# EAGLE schematic LoRaBUG_RGBW_DaughterBoard (EAGLE 8.2.1)
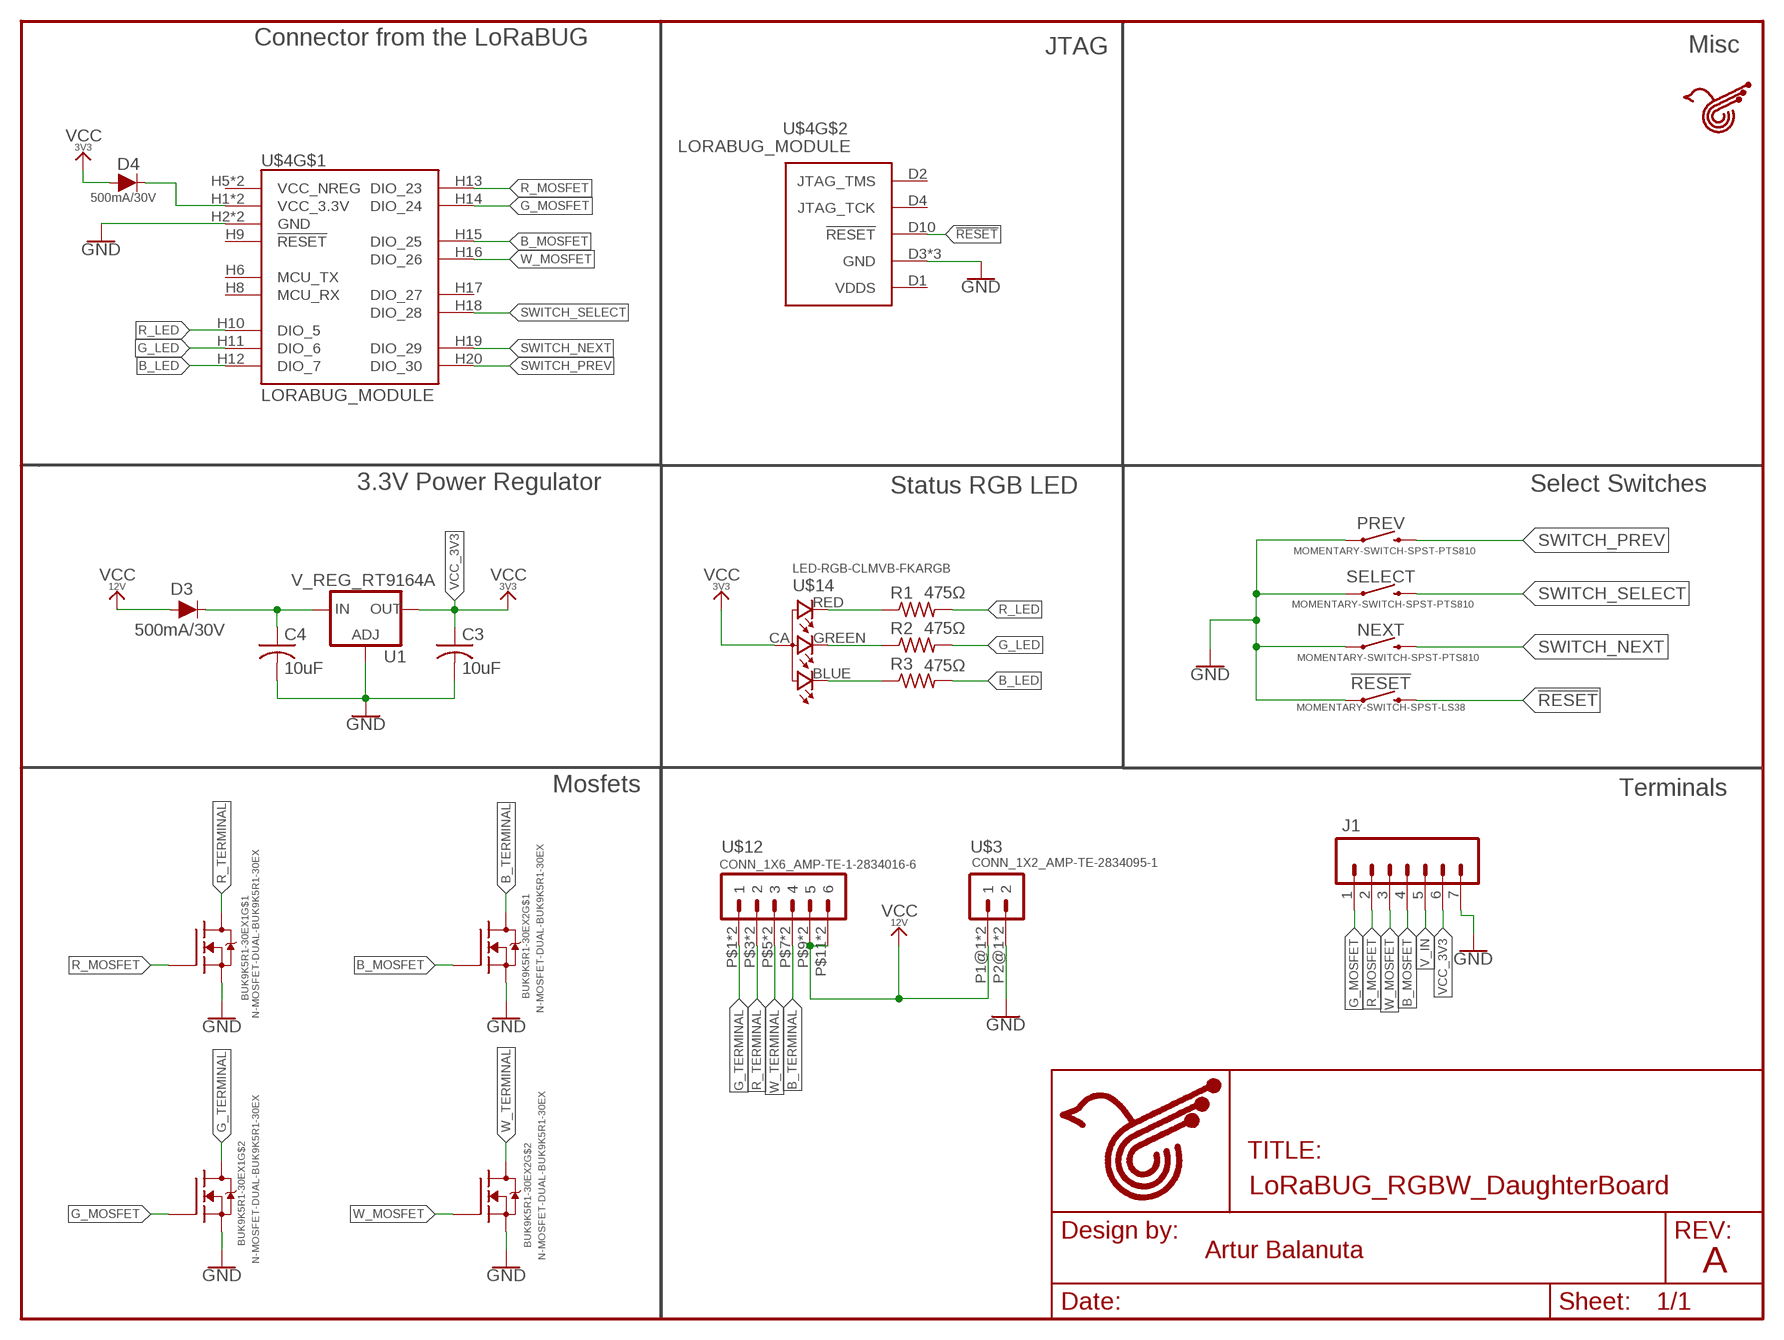
[diagram p0: schematic, sheet 1]

## Parts
!RESET  MOMENTARY-SWITCH-SPST-LS38  [TACTILE_SWITCH_SMD_3.3X3.1MM_LS38]
BUK9K5R1-30EX1  N-MOSFET-DUAL-BUK9K5R1-30EX  [LFPAK56D]
BUK9K5R1-30EX2  N-MOSFET-DUAL-BUK9K5R1-30EX  [LFPAK56D]
C3  10uF  C-USC0603K  [C0603K]
C4  10uF  C-USC0603K  [C0603K]
D3  500mA/30V  DIODE-NSR0530HT1G"  [SOD-323]
D4  500mA/30V  DIODE-NSR0530HT1G"  [SOD-323]
J1  CONN_07NO_SILK  [1X07_NO_SILK]
NEXT  MOMENTARY-SWITCH-SPST-PTS810  [TACTILE_SWITCH_SMD_4.2X3.2MM]
PREV  MOMENTARY-SWITCH-SPST-PTS810  [TACTILE_SWITCH_SMD_4.2X3.2MM]
R1  475Ω  R-US_R0603  [R0603]
R2  475Ω  R-US_R0603  [R0603]
R3  475Ω  R-US_R0603  [R0603]
SELECT  MOMENTARY-SWITCH-SPST-PTS810  [TACTILE_SWITCH_SMD_4.2X3.2MM]
U1  V_REG_RT9164A  [SOT223]
U$3  CONN_1X2_AMP-TE-2834095-1  [CONN_1X2_AMP-TE-2834095-1]
U$4  LORABUG_MODULE  [LORABUG_MODULE]
U$5  OPENCHIR_LOGO_PCB  [OPENCHIRP_LOGO_S]
U$12  CONN_1X6_AMP-TE-1-2834016-6  [CONN_1X6_AMP-TE-1-2834016-6]
U$14  LED-RGB-CLMVB-FKARGB  [PLCC4-2MM-RGB]

## Nets
!RESET: !RESET.P$3 !RESET.P$4 U$4.D10(!RESET)
B_LED: R3.2 U$4.H12(DIO_7)
B_MOSFET: BUK9K5R1-30EX2.P$2(G) J1.4 U$4.H15(DIO_25)
B_TERMINAL: BUK9K5R1-30EX2.P$7(D) BUK9K5R1-30EX2.P$8(D) U$12.P$7 U$12.P$8
G_LED: R2.2 U$4.H11(DIO_6)
G_MOSFET: BUK9K5R1-30EX1.P$4(G) J1.1 U$4.H14(DIO_24)
G_TERMINAL: BUK9K5R1-30EX1.P$5(D) BUK9K5R1-30EX1.P$6(D) U$12.P$1 U$12.P$2
GND: !RESET.P$1 !RESET.P$2 BUK9K5R1-30EX1.P$1(S) BUK9K5R1-30EX1.P$3(S) BUK9K5R1-30EX2.P$1(S) BUK9K5R1-30EX2.P$3(S) C3.2 C4.2 J1.7 NEXT.P$1 NEXT.P$2 PREV.P$1 PREV.P$2 SELECT.P$1 SELECT.P$2 U1.1(ADJ) U$3.P2@1 U$3.P2@2 U$4.D3(GND) U$4.D5(GND) U$4.D9(GND) U$4.H2(GND) U$4.H4(GND)
N$1: R1.1 U$14.RED
N$2: R2.1 U$14.GREEN
N$3: R3.1 U$14.BLUE
N_VIN: C4.1 D3.C U1.3(IN)
R_LED: R1.2 U$4.H10(DIO_5)
R_MOSFET: BUK9K5R1-30EX1.P$2(G) J1.2 U$4.H13(DIO_23)
R_TERMINAL: BUK9K5R1-30EX1.P$7(D) BUK9K5R1-30EX1.P$8(D) U$12.P$3 U$12.P$4
SWITCH_NEXT: NEXT.P$3 NEXT.P$4 U$4.H19(DIO_29)
SWITCH_PREV: PREV.P$3 PREV.P$4 U$4.H20(DIO_30)
SWITCH_SELECT: SELECT.P$3 SELECT.P$4 U$4.H18(DIO_28)
V_IN: D4.C J1.5 U$4.H1(VCC_3.3V) U$4.H3(VCC_3.3V)
VCC_3V3: C3.1 D4.A J1.6 U1.2(OUT) U1.4(OUT) U$14.CA
VCC_12V: D3.A U$3.P1@1 U$3.P1@2 U$12.P$9 U$12.P$10 U$12.P$11 U$12.P$12
W_MOSFET: BUK9K5R1-30EX2.P$4(G) J1.3 U$4.H16(DIO_26)
W_TERMINAL: BUK9K5R1-30EX2.P$5(D) BUK9K5R1-30EX2.P$6(D) U$12.P$5 U$12.P$6
Unconnected: U$4.D2(JTAG_TMS) U$4.D4(JTAG_TCK) U$4.H6(MCU_TX) U$4.H8(MCU_RX) U$4.H9(!RESET) U$4.H17(DIO_27)

## Notes on the sheet
- Connector from the LoRaBUG | Misc
- JTAG
- 3.3V Power Regulator | Status RGB LED | Select Switches
- Mosfets | Terminals
- Artur Balanuta
- A

## Power pins joined to a net without a drawn wire
VCC_NREG: U$4.H5(VCC_NREG) U$4.H7(VCC_NREG)
VDDS: U$4.D1(VDDS)

## Library data of the parts
!RESET NEXT PREV SELECT = LoRaBUG_RGBW_Board:MOMENTARY-SWITCH-SPST
BUK9K5R1-30EX1 BUK9K5R1-30EX2 = LoRaBUG_RGBW_Board:N-MOSFET-DUAL: Dual N-channel TrenchMOS standard level FET NXP Semiconductor. 30V 40A LFPAK56D (SOT 1205)
C3 C4 = resistor:C-US: CAPACITOR, American symbol
D3 D4 = LoRaBUG_RGBW_Board:DIODE-NSR0530HT1G: https://www.digikey.com/product-detail/en/on-semiconductor/NSR0530HT1G/NSR0530HT1GOSCT-ND/5761654; PROD_ID: NSR0530HT1GOSCT-ND
J1 = SparkFun-Connectors:CONN_07: Multi connection point. Often used as Generic Header-pin footprint for 0.1 inch spaced/style header connections On any of the 0.1 inch spaced packages, you can populate with these: Break Away Headers - Straight <https://www.sparkfun.com/products/116> (PRT-00116) Break Away Male Headers - Right Angle <https://www.sparkfun.com/products/553> (PRT-00553) Female Headers <https://www.sparkfun.com/products/115> (PRT-00115) Break Away Headers - Machine Pin <https://www.sparkfun.com/products/117> (PRT-00117) Break Away Female Headers - Swiss Machine Pin <https://www.sparkfun.com/products/743> (PRT-00743) For SCREWTERMINALS and SPRING TERMINALS visit here: Screw Terimnals on SparkFun.com <https://www.sparkfun.com/search/results?term=Screw+Terminals> (5mm/3.5mm/2.54mm spacing) This device is also useful as a general connection point to wire up your design to another part of your project. Our various solder wires solder well into these plated through hole pads. Hook-Up Wire - Assortment (Stranded, 22 AWG) <https://www.sparkfun.com/products/11375> (PRT-11375) Hook-Up Wire - Assortment (Solid Core, 22 AWG) <https://www.sparkfun.com/products/11367> (PRT-11367) View the entire wire category on our website here <https://www.sparkfun.com/categories/141> Special notes: Molex polarized connector foot print use with SKU : PRT-08231 with associated crimp pins and housings. 1MM SMD Version SKU: PRT-10208 NOTES ON THE VARIANTS LOCK and LOCK_LONGPADS... This footprint was designed to help hold the alignment of a through-hole component (i.e. 6-pin header) while soldering it into place. You may notice that each hole has been shifted either up or down by 0.005 of an inch from it's more standard position (which is a perfectly straight line). This slight alteration caused the pins (the squares in the middle) to touch the edges of the holes. Because they are alternating, it causes a "brace" to hold the component in place. 0.005 has proven to be the perfect amount of "off-center" position when using our standard breakaway headers. Although looks a little odd when you look at the bare footprint, once you have a header in there, the alteration is very hard to notice. Also,if you push a header all the way into place, it is covered up entirely on the bottom side.
R1-R3 = resistor:R-US_: RESISTOR, American symbol
U1 = LoRaBUG_RGBW_Board:V_REG_RT9164A: RT9164A Voltage Regulator 1A Fixed and Adjustable Low Dropout Positive Voltage Regulators Features  Low Dropout Performance, 1.4V Max  Full Current Rating Over Line and Temperature  Fast Transient Response  ±2% Output Voltage Accuracy  1.5V, 1.8V, 2.5V, 2.85V, 3.0V, 3.3V, and 3.5V Fixed Adjustable Output Voltage  SOT-223, TO-252, and TO-263 Packages  RoHS Compliant and 100% Lead (Pb)-Free
U$3 = LoRaBUG_RGBW_Board:CONN_1X2_AMP-TE-2834095-1
U$4 = LoRaBUG_RGBW_Board:LORABUG_MODULE
U$5 = Frames:OPENCHIR_LOGO_PCB
U$12 = LoRaBUG_RGBW_Board:CONN_1X6_AMP-TE-1-2834016-6: 6 Position Wire to Board Terminal Block Horizontal with Board 0.100" (2.54mm) Through Hole Manufacturer TE Connectivity AMP Connectors Manufacturer Part Number 1-2834016-6 Description 6POS 2.54MM SES CONN https://www.digikey.com/product-detail/en/te-connectivity-amp-connectors/1-2834016-6/A123832-ND/5872948
U$14 = LoRaBUG_RGBW_Board:LED-RGB-CLMVB-FKA: CREE CLMVB-FKA RGB LED 2mm x 2mm